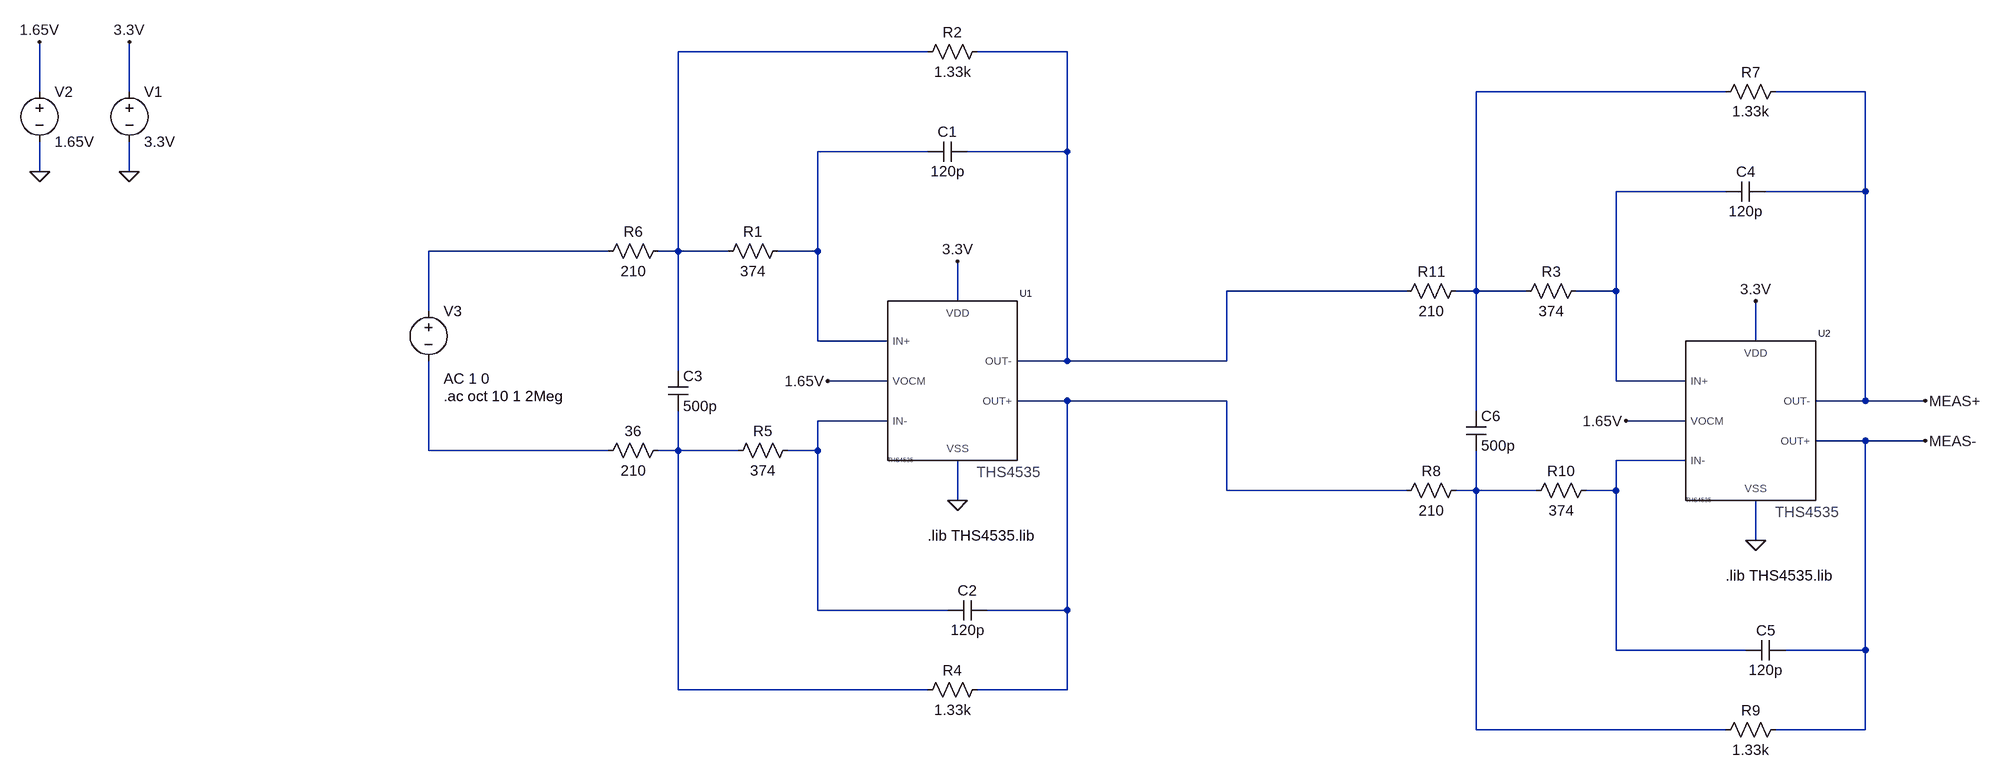
[diagram p0: schematic Sense FDA Filters.asc]
Sense FDA Filters.asc, the LTspice schematic file:
Version 4
SHEET 1 1860 784
WIRE 160 -352 -240 -352
WIRE 384 -352 240 -352
WIRE -1264 -288 -1264 -368
WIRE -1120 -288 -1120 -368
WIRE 1440 -288 1040 -288
WIRE 1664 -288 1520 -288
WIRE 160 -192 -16 -192
WIRE 384 -192 384 -352
WIRE 384 -192 224 -192
WIRE -1264 -160 -1264 -208
WIRE -1120 -160 -1120 -208
WIRE 1440 -128 1264 -128
WIRE 1664 -128 1664 -288
WIRE 1664 -128 1504 -128
WIRE -352 -32 -640 -32
WIRE -240 -32 -240 -352
WIRE -240 -32 -272 -32
WIRE -160 -32 -240 -32
WIRE -16 -32 -16 -192
WIRE -16 -32 -80 -32
WIRE 928 32 640 32
WIRE 1040 32 1040 -288
WIRE 1040 32 1008 32
WIRE 1120 32 1040 32
WIRE 1264 32 1264 -128
WIRE 1264 32 1200 32
WIRE 208 48 208 -16
WIRE -640 64 -640 -32
WIRE -16 112 -16 -32
WIRE 96 112 -16 112
WIRE 1488 112 1488 48
WIRE 384 144 384 -192
WIRE 384 144 304 144
WIRE 640 144 640 32
WIRE 640 144 384 144
WIRE -240 160 -240 -32
WIRE 96 176 0 176
WIRE 1264 176 1264 32
WIRE 1376 176 1264 176
WIRE 384 208 304 208
WIRE 640 208 384 208
WIRE 1664 208 1664 -128
WIRE 1664 208 1584 208
WIRE 1760 208 1664 208
WIRE 1040 224 1040 32
WIRE 96 240 -16 240
WIRE 1376 240 1280 240
WIRE 1664 272 1584 272
WIRE 1760 272 1664 272
WIRE -640 288 -640 144
WIRE -352 288 -640 288
WIRE -240 288 -240 224
WIRE -240 288 -272 288
WIRE -144 288 -240 288
WIRE -16 288 -16 240
WIRE -16 288 -64 288
WIRE 1376 304 1264 304
WIRE 640 352 640 208
WIRE 928 352 640 352
WIRE 1040 352 1040 288
WIRE 1040 352 1008 352
WIRE 1136 352 1040 352
WIRE 1264 352 1264 304
WIRE 1264 352 1216 352
WIRE 208 368 208 304
WIRE 1488 432 1488 368
WIRE -16 544 -16 288
WIRE 192 544 -16 544
WIRE 384 544 384 208
WIRE 384 544 256 544
WIRE 1264 608 1264 352
WIRE 1472 608 1264 608
WIRE 1664 608 1664 272
WIRE 1664 608 1536 608
WIRE -240 672 -240 288
WIRE 160 672 -240 672
WIRE 384 672 384 544
WIRE 384 672 240 672
WIRE 1040 736 1040 352
WIRE 1440 736 1040 736
WIRE 1664 736 1664 608
WIRE 1664 736 1520 736
FLAG 208 368 0
FLAG -1120 -160 0
FLAG -1120 -368 3.3V
FLAG 208 -16 3.3V
FLAG -1264 -160 0
FLAG -1264 -368 1.65V
FLAG 0 176 1.65V
FLAG 1488 432 0
FLAG 1488 48 3.3V
FLAG 1280 240 1.65V
FLAG 1760 208 MEAS+
FLAG 1760 272 MEAS-
SYMBOL THS4535 96 304 R0
WINDOW 3 0 0 Left 0
SYMATTR SpiceModel ""
SYMATTR InstName U1
SYMBOL res -64 -48 R90
WINDOW 0 0 56 VBottom 2
WINDOW 3 32 56 VTop 2
SYMATTR InstName R1
SYMATTR Value 374
SYMBOL res 256 -368 R90
WINDOW 0 0 56 VBottom 2
WINDOW 3 32 56 VTop 2
SYMATTR InstName R2
SYMATTR Value 1.33k
SYMBOL cap 224 -208 R90
WINDOW 0 0 32 VBottom 2
WINDOW 3 32 32 VTop 2
SYMATTR InstName C1
SYMATTR Value 120p
SYMBOL cap 256 528 R90
WINDOW 0 0 32 VBottom 2
WINDOW 3 32 32 VTop 2
SYMATTR InstName C2
SYMATTR Value 120p
SYMBOL res -256 272 R90
WINDOW 0 0 56 VBottom 2
WINDOW 3 32 56 VTop 2
SYMATTR InstName 36
SYMATTR Value 210
SYMBOL voltage -1120 -304 R0
WINDOW 123 0 0 Left 0
WINDOW 39 0 0 Left 0
SYMATTR InstName V1
SYMATTR Value 3.3V
SYMBOL res 256 656 R90
WINDOW 0 0 56 VBottom 2
WINDOW 3 32 56 VTop 2
SYMATTR InstName R4
SYMATTR Value 1.33k
SYMBOL res -48 272 R90
WINDOW 0 0 56 VBottom 2
WINDOW 3 32 56 VTop 2
SYMATTR InstName R5
SYMATTR Value 374
SYMBOL cap -256 160 R0
SYMATTR InstName C3
SYMATTR Value 500p
SYMBOL voltage -1264 -304 R0
WINDOW 123 0 0 Left 0
WINDOW 39 0 0 Left 0
SYMATTR InstName V2
SYMATTR Value 1.65V
SYMBOL res -256 -48 R90
WINDOW 0 0 56 VBottom 2
WINDOW 3 32 56 VTop 2
SYMATTR InstName R6
SYMATTR Value 210
SYMBOL voltage -640 48 R0
WINDOW 123 24 124 Left 2
WINDOW 39 0 0 Left 0
SYMATTR InstName V3
SYMATTR Value ""
SYMATTR Value2 AC 1 0
SYMBOL THS4535 1376 368 R0
WINDOW 3 0 0 Left 0
SYMATTR SpiceModel ""
SYMATTR InstName U2
SYMBOL res 1216 16 R90
WINDOW 0 0 56 VBottom 2
WINDOW 3 32 56 VTop 2
SYMATTR InstName R3
SYMATTR Value 374
SYMBOL res 1536 -304 R90
WINDOW 0 0 56 VBottom 2
WINDOW 3 32 56 VTop 2
SYMATTR InstName R7
SYMATTR Value 1.33k
SYMBOL cap 1504 -144 R90
WINDOW 0 0 32 VBottom 2
WINDOW 3 32 32 VTop 2
SYMATTR InstName C4
SYMATTR Value 120p
SYMBOL cap 1536 592 R90
WINDOW 0 0 32 VBottom 2
WINDOW 3 32 32 VTop 2
SYMATTR InstName C5
SYMATTR Value 120p
SYMBOL res 1024 336 R90
WINDOW 0 0 56 VBottom 2
WINDOW 3 32 56 VTop 2
SYMATTR InstName R8
SYMATTR Value 210
SYMBOL res 1536 720 R90
WINDOW 0 0 56 VBottom 2
WINDOW 3 32 56 VTop 2
SYMATTR InstName R9
SYMATTR Value 1.33k
SYMBOL res 1232 336 R90
WINDOW 0 0 56 VBottom 2
WINDOW 3 32 56 VTop 2
SYMATTR InstName R10
SYMATTR Value 374
SYMBOL cap 1024 224 R0
SYMATTR InstName C6
SYMATTR Value 500p
SYMBOL res 1024 16 R90
WINDOW 0 0 56 VBottom 2
WINDOW 3 32 56 VTop 2
SYMATTR InstName R11
SYMATTR Value 210
TEXT -616 200 Left 2 !.ac oct 10 1 2Meg
TEXT 160 424 Left 2 !.lib THS4535.lib
TEXT 1440 488 Left 2 !.lib THS4535.lib

The netlist it stands for:
* Sense FDA Filters.asc
XU1 N004 N008 1.65V N007 N002 0 3.3V THS4535  ; pins IN+ IN- VOCM OUT+ OUT- VSS VDD
R1 N004 N001 374
R2 N002 N001 1.33k
C1 N002 N004 120p
C2 N007 N008 120p
R§36 N010 N009 210
V1 3.3V 0 3.3V
R4 N007 N010 1.33k
R5 N008 N010 374
C3 N001 N010 500p
V2 1.65V 0 1.65V
R6 N001 N006 210
V3 N006 N009 AC 1 0
XU2 N005 N011 1.65V MEAS- MEAS+ 0 3.3V THS4535  ; pins IN+ IN- VOCM OUT+ OUT- VSS VDD
R3 N005 N003 374
R7 MEAS+ N003 1.33k
C4 MEAS+ N005 120p
C5 MEAS- N011 120p
R8 N012 N007 210
R9 MEAS- N012 1.33k
R10 N011 N012 374
C6 N003 N012 500p
R11 N003 N002 210
.ac oct 10 1 2Meg
.lib THS4535.lib
.lib THS4535.lib
.backanno
.end